# EAGLE design rfidReader (EAGLE 5.04)
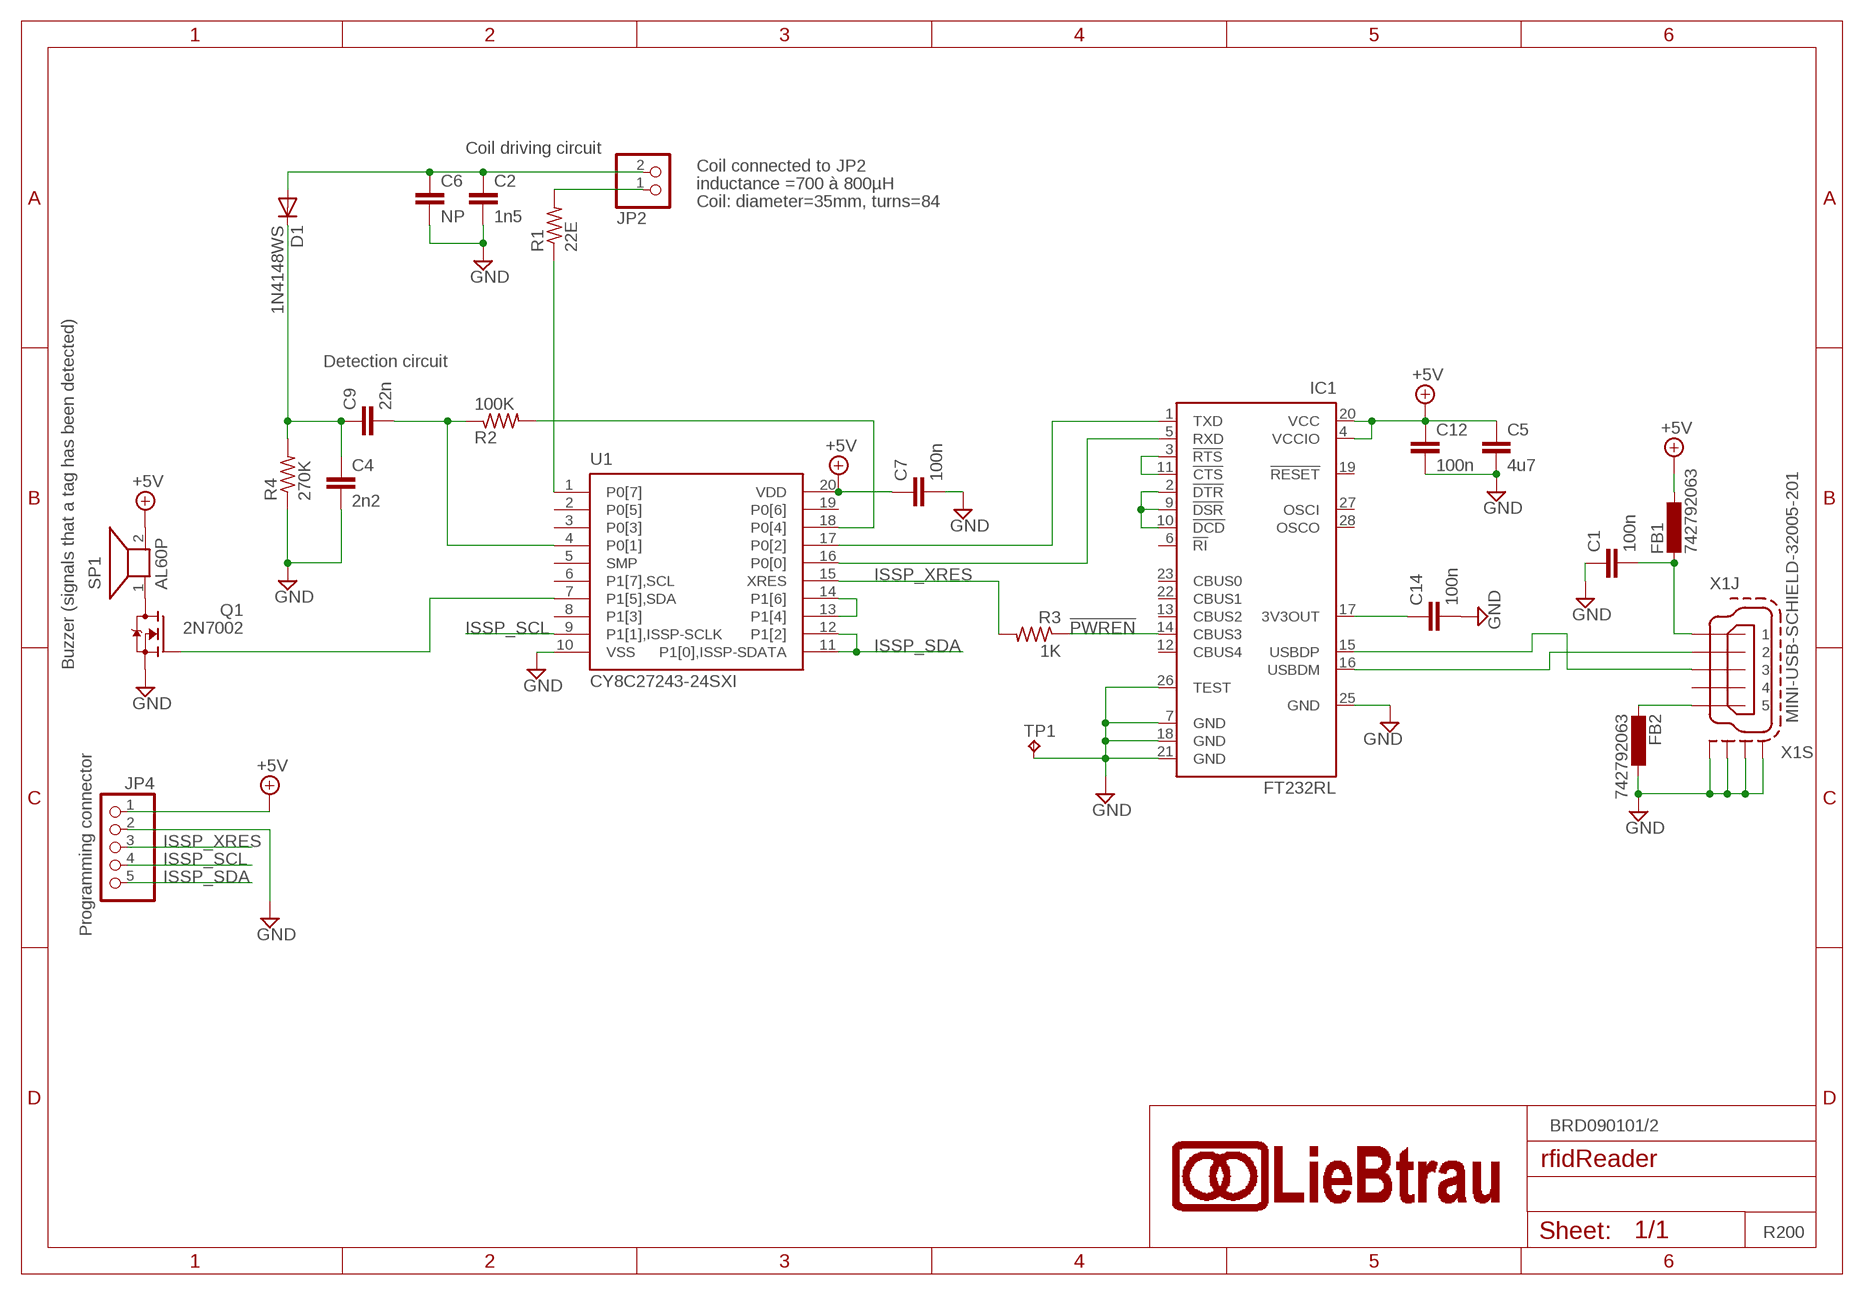
[diagram p0: schematic, sheet 1]

## Parts
C1  100n  C-EUC0805  [C0805]
C2  1n5  C-EUC0805  [C0805]
C4  2n2  C-EUC0805  [C0805]
C5  4u7  C-EUC1206  [C1206]
C6  NP  C-EUC1206  [C1206]
C7  100n  C-EUC0805  [C0805]
C9  22n  C-EUC0805  [C0805]
C12  100n  C-EUC0805  [C0805]
C14  100n  C-EUC0805  [C0805]
D1  1N4148WS  DIODE-SOD323-W  [SOD323-W]
FB1  742792063  [C0805]
FB2  742792063  [C0805]
IC1  FT232RL  [SSOP28]
JP2  PINHD-1X2  [1X02]
JP4  PINHD-1X5  [1X05]
Q1  2N7002  [SOT23]
R1  22E  R-US_R1206  [R1206]
R2  100K  R-US_R0805  [R0805]
R3  1K  R-US_R0805  [R0805]
R4  270K  R-US_R1206  [R1206]
SP1  AL60P  [AL60P]
TP1  TPPAD1-13Y  [P1-13Y]
U1  CY8C27243-24SXI  [SO20W]
X1  MINI-USB-SCHIELD-32005-201  [32005-201]

## Nets
!PWREN: IC1.14(CBUS3) R3.1
+5V: C5.1 C7.1 C12.1 FB1.1 IC1.4(VCCIO) IC1.20(VCC) JP4.1 SP1.2 U1.20(VDD)
GND: C1.1 C2.2 C4.2 C5.2 C6.2 C7.2 C12.2 C14.2 FB2.1 IC1.7(GND) IC1.18(GND) IC1.21(GND) IC1.25(GND) IC1.26(TEST) JP4.2 Q1.2(S) R4.1 TP1.1(TP) U1.10(VSS) X1.M1(S:S1) X1.M2(S:S2) X1.M3(S:S3) X1.M4(S:S4)
ISSP_SCL: JP4.4 U1.9(P1[1],ISSP-SCLK)
ISSP_SDA: JP4.5 U1.11(P1[0],ISSP-SDATA) U1.12(P1[2])
ISSP_XRES: JP4.3 R3.2 U1.15(XRES)
N$1: R1.1 U1.1(P0[7])
N$2: R2.2 U1.18(P0[4])
N$5: JP2.1 R1.2
N$7: FB2.2 X1.5
N$8: IC1.1(TXD) U1.17(P0[2])
N$9: IC1.5(RXD) U1.16(P0[0])
N$11: C4.1 C9.1 D1.C R4.2
N$12: C2.1 C6.1 D1.A JP2.2
N$13: U1.13(P1[4]) U1.14(P1[6])
N$14: IC1.3(!RTS) IC1.11(!CTS)
N$15: IC1.2(!DTR) IC1.9(!DSR) IC1.10(!DCD)
N$16: Q1.1(G) U1.7(P1[5],SDA)
N$17: Q1.3(D) SP1.1
N$21: C1.2 FB1.2 X1.1
N$22: C9.2 R2.1 U1.4(P0[1])
N$27: C14.1 IC1.17(3V3OUT)
USBDM: IC1.16(USBDM) X1.2
USBDP: IC1.15(USBDP) X1.3
Unconnected: IC1.6(!RI) IC1.12(CBUS4) IC1.13(CBUS2) IC1.19(!RESET) IC1.22(CBUS1) IC1.23(CBUS0) IC1.27(OSCI) IC1.28(OSCO) U1.2(P0[5]) U1.3(P0[3]) U1.5(SMP) U1.6(P1[7],SCL) U1.8(P1[3]) U1.19(P0[6]) X1.4

## Notes on the sheet
- Coil driving circuit
- Coil connected to JP2
- inductance =700 à 800µH
- Coil: diameter=35mm, turns=84
- Detection circuit
- Buzzer (signals that a tag has been detected)
- Programming connector
- BRD090101/2
- R200

## Library data of the parts
C1 C2 C4-C7 C9 C12 C14 = rcl:C-EU: CAPACITOR, European symbol
D1 = diode:DIODE-: DIODE
FB1 FB2 = rfid:742792063: WUERTH ELEKTRONIK 742792063 FERRITE, SMD 60OHM, 3A, 0805Series:WE-CBF; Current rating:3000mA; Resistance:0.025ohm; Package/Case:0805; Impedance, typical @ 100 MHz:60ohm;
IC1 = ftdichip:FT232R: Source: http://www.ftdichip.com/Documents/DataSheets/DS_FT232R_v104.pdf
JP2 = pinhead:PINHD-1X2: PIN HEADER
JP4 = pinhead:PINHD-1X5: PIN HEADER
Q1 = rfid:2N7002
R1-R4 = rcl:R-US_: RESISTOR, American symbol
SP1 = buzzer:AL60P: SPEAKER Source: Buerklin
TP1 = testpad:TP: Test pad
U1 = rfid:CY8C27243
X1 = rfid:MINI-USB-SCHIELD-: MINI USB-B Conector Source: www.cypressindustries.com

## Board
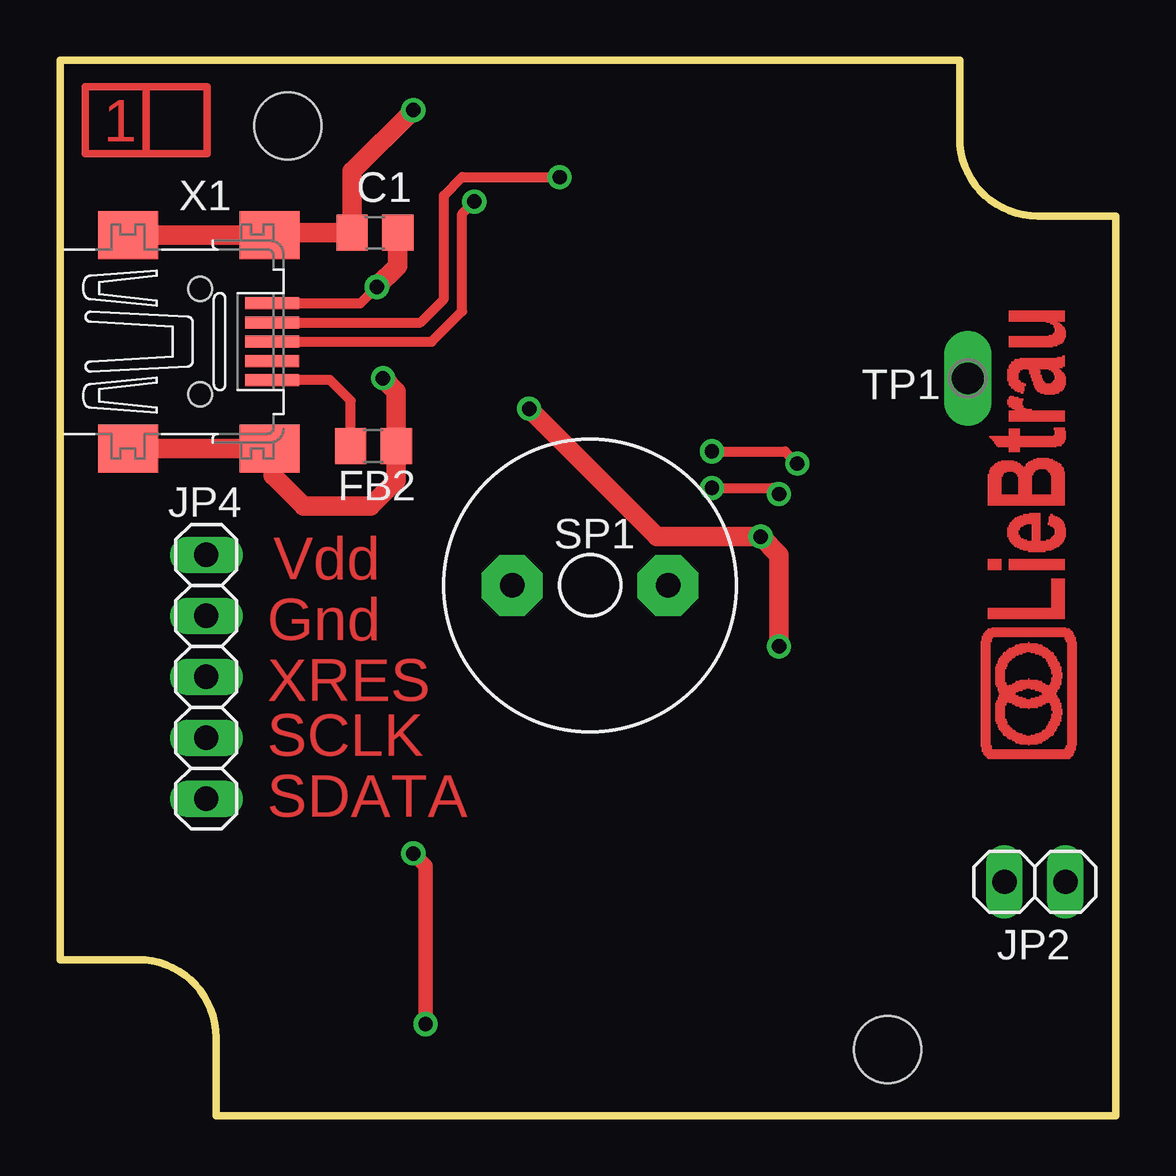
[diagram p1: board, top side]
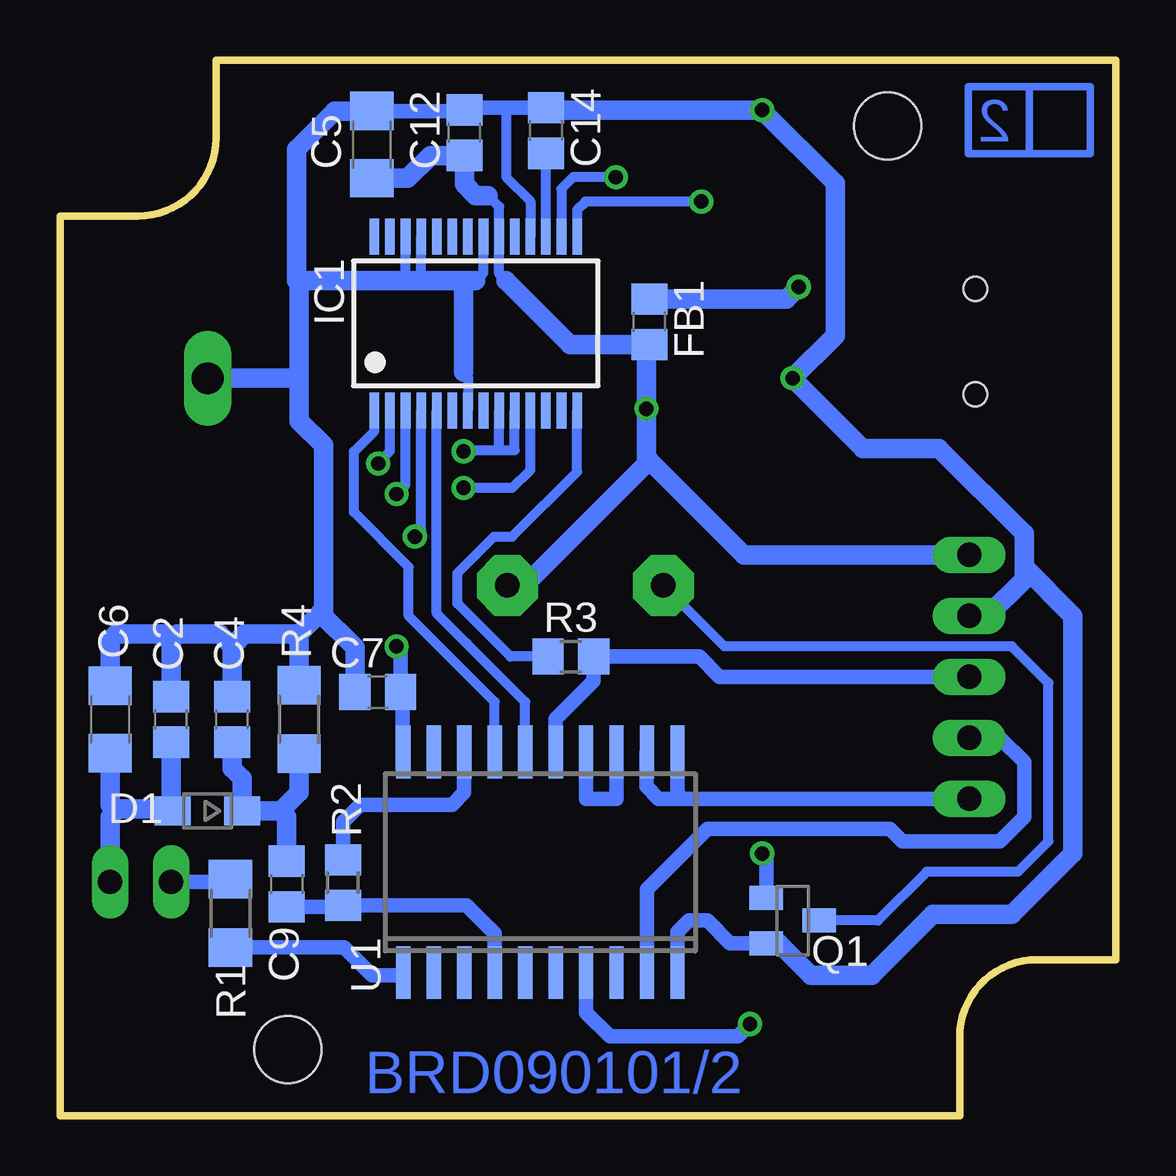
[diagram p2: board, bottom side, seen from below]

Size 44 x 44 mm. Coordinates in mm from the lower left corner, seen from the top.
Outline: 0,44 37.5,44 37.5,40.75 arc90 40.75,37.5 44,37.5 44,0 6.5,0 6.5,3.25 arc90 3.25,6.5 0,6.5 0,44
Copper layers (1*16): Top 0.035mm / dielectric 1.5mm / Bottom 0.035mm
Design rules "default *": minimum track width 10mil, minimum drill 0.6mm, track to track 8mil, track to pad 8mil, pad to pad 8mil, via to via 8mil, smd to smd 8mil, copper to edge 40mil, drill to drill 8mil, minimum pad ring 10mil, minimum via ring 8mil, stop-mask expansion 4mil, vias tented up to drill 0mil, thermal gap 10mil
Holes 2.8 mm at 9.5,41.25 34.5,2.75

### Footprints (pad centres in the part's own frame; a part is rotated, then mirrored left to right if it is on the bottom)
C0805 = smd 1.3 x 1.5: 1 -0.95,0; 2 0.95,0
C1206 = smd 1.6 x 1.8: 1 -1.4,0; 2 1.4,0
SOD323-W = smd 1.5 x 1.2: A 1.45,0; C -1.45,0
SSOP28 = smd 0.4 x 1.5: 1 -4.225,-3.625; 2 -3.575,-3.625; 3 -2.925,-3.625; 4 -2.275,-3.625; 5 -1.625,-3.625; 6 -0.975,-3.625; 7 -0.325,-3.625; 8 0.325,-3.625; 9 0.975,-3.625; 10 1.625,-3.625; 11 2.275,-3.625; 12 2.925,-3.625; 13 3.575,-3.625; 14 4.225,-3.625; 15 4.225,3.625; 16 3.575,3.625; 17 2.925,3.625; 18 2.275,3.625; 19 1.625,3.625; 20 0.975,3.625; 21 0.325,3.625; 22 -0.325,3.625; 23 -0.975,3.625; 24 -1.625,3.625; 25 -2.275,3.625; 26 -2.925,3.625; 27 -3.575,3.625; 28 -4.225,3.625
1X02 = drill 1.016 long: 1 -1.27,0; 2 1.27,0
1X05 = drill 1.016 long: 1 -5.08,0; 2 -2.54,0; 3 0,0; 4 2.54,0; 5 5.08,0
SOT23 = smd 1 x 1.4: 1 -0.95,-1.1; 2 0.95,-1.1; 3 0,1.1
R1206 = smd 1.6 x 1.803: 1 -1.422,0; 2 1.422,0
R0805 = smd 1.3 x 1.5: 1 -0.95,0; 2 0.95,0
AL60P = drill 1.016 pad 2.54 octagon: 1 -3.251,0; 2 3.251,0
P1-13Y = drill 1.321 pad 1.905 long: 1 0,0
SO20W = smd 0.6 x 2.2: 1 -5.715,-4.6; 2 -4.445,-4.6; 3 -3.175,-4.6; 4 -1.905,-4.6; 5 -0.635,-4.6; 6 0.635,-4.6; 7 1.905,-4.6; 8 3.175,-4.6; 9 4.445,-4.6; 10 5.715,-4.6; 11 5.715,4.6; 12 4.445,4.6; 13 3.175,4.6; 14 1.905,4.6; 15 0.635,4.6; 16 -0.635,4.6; 17 -1.905,4.6; 18 -3.175,4.6; 19 -4.445,4.6; 20 -5.715,4.6
32005-201 = smd 2.25 x 0.5: 1 3,1.6; 2 3,0.8; 3 3,0; 4 3,-0.8; 5 3,-1.6 | smd 2.5 x 2: M1 -3,-4.45; M2 -3,4.45; M3 2.9,4.45; M4 2.9,-4.45 | hole 1: 0,2.2; 0,-2.2

### Placement (x,y rotation side)
C1  13.13,36.79 0 top
C2  39.37,16.51 90 bottom
C4  36.83,16.51 90 bottom
C5  31,40.47 90 bottom
C6  41.91,16.51 90 bottom
C7  30.76,17.65 180 bottom
C9  34.54,9.65 270 bottom
C12  27.14,40.97 90 bottom
C14  23.74,41.06 90 bottom
D1  37.85,12.7 180 bottom
FB1  19.43,33.09 90 bottom
FB2  13.07,27.91 180 top
IC1  26.67,33.02 0 bottom
JP2  40.64,9.74 0 top
JP4  6.1,18.29 270 top
Q1  13.46,8.13 270 bottom
R1  36.89,8.42 90 bottom
R2  32.2,9.71 90 bottom
R3  22.7,19.13 0 bottom
R4  34.04,16.51 270 bottom
SP1  22.1,22.1 0 top
TP1  37.85,30.73 180 top
U1  23.98,10.56 0 bottom
U$1  [LIEBTRAU_PCB]  43.18,14.22 90 top
U$2  [A5L-LOC]  -67.31,-51.82 0 top  (outside the outline)
X1  5.84,32.26 0 top

### Tracks (layer width: path | path; a pad name or v marks a point on that pad's centre or on a via)
!PWREN
  Bottom 0.406: IC1.14 22.45,26.83 25.15,24.13 25.91,24.13 27.43,22.61 27.43,21.34 25.23,19.13 R3.1
+5V  (via drill 0.6)
  Top 0.813: v19.56,29.46 24.89,24.13 v29.21,24.13 29.97,23.37 v29.97,19.56
  Bottom 0.406: 26.16,38.35 25.7,37.89 IC1.20 25.7,35.09 25.4,34.8 | IC1.4 28.95,24.37 28.97,24.37 v29.21,24.13
  Bottom 0.61: 29.72,15.13 29.72,14.48 | 29.72,15.13 U1.20 | 29.72,15.13 29.72,17.65 C7.1 29.81,19.22 arc-90 30.06,19.47
  Bottom 0.813: 26.16,38.35 26.67,38.35 27.14,38.82 C12.1 28.56,40.02 29.51,39.07 C5.1 | 25.4,34.8 22.74,32.14 FB1.1 19.56,32.01 v19.56,29.46 19.56,27.43 19.43,27.3 | JP4.1 15.49,23.37 19.43,27.3 | SP1.2 24.64,22.1 19.43,27.3 | v29.97,19.56 30.06,19.47
GND  (via drill 0.6)
  Top 0.813: X1.M2 X1.M3 8.83,36.79 C1.1 12.18,39.36 v14.73,41.91 | X1.M1 X1.M4 8.89,27.66 8.89,26.67 10.16,25.4 12.95,25.4 14.02,26.46 FB2.1 14.02,30.18 v13.46,30.73
  Bottom 0.406: IC1.18 24.39,38.11 25.4,39.12 25.4,42.01 | IC1.26 29.59,34.93 29.46,34.8 | IC1.25 28.95,34.81 28.96,34.8 | IC1.21 26.34,35.12 26.67,34.8 | IC1.7 27,30.8 27.18,30.99
  Bottom 0.61: C14.2 25.4,42.01 27.05,42.01 C12.2 27.19,41.87 C5.2 | Q1.2 16.07,7.18 17.02,8.13 17.78,8.13 18.26,7.65 U1.10
  Bottom 0.813: C14.2 23.64,41.91 v14.73,41.91 11.68,38.86 11.68,32.51 v13.46,30.73 10.54,27.81 7.37,27.81 3.81,24.25 3.81,22.86 | 27.18,34.8 28.93,34.8 28.95,34.81 | 27.18,34.8 26.67,34.8 | 29.21,34.8 28.96,34.8 | 29.21,34.8 29.46,34.8 | 34.14,34.8 34.14,40.28 32.55,41.87 C5.2 | 34.14,34.8 29.21,34.8 | 27.18,34.8 27.18,30.99 | 34.04,30.73 34.04,34.7 34.14,34.8 | 34.04,30.73 34.04,28.96 33.02,27.94 33.02,21.08 33.15,20.95 | C6.2 41.91,19.81 41.66,20.07 39.62,20.07 39.37,19.81 | 39.37,19.81 C2.2 | 36.83,19.56 37.34,20.07 39.12,20.07 39.37,19.81 | 36.83,19.56 C4.2 | 36.83,19.56 36.32,20.07 34.29,20.07 34.04,19.81 R4.1 34.04,20.07 33.15,20.95 | JP4.2 5.33,20.83 3.81,22.35 3.81,22.86 | Q1.2 14.04,7.18 12.7,5.84 10.16,5.84 7.62,8.38 4.32,8.38 1.78,10.92 1.78,20.83 3.81,22.86 | 34.04,30.73 TP1.1 | C7.2 31.71,19.51 33.15,20.95
ISSP_SCL
  Bottom 0.61: U1.9 19.53,9.43 17.02,11.94 9.4,11.94 8.89,11.43 4.83,11.43 3.81,12.45 3.81,14.73 4.83,15.75 JP4.4
ISSP_SDA
  Bottom 0.61: JP4.5 18.03,13.21 | 18.03,13.21 19.05,13.21 19.56,13.72 19.56,15.13 U1.12 | U1.11 18.26,13.44 18.03,13.21
ISSP_XRES
  Bottom 0.61: U1.15 23.34,16.54 21.75,18.12 R3.2 17.35,19.13 16.51,18.29 JP4.3
N$1
  Bottom 0.61: R1.1 32.15,7 30.99,5.84 29.81,5.84 U1.1
N$2
  Bottom 0.61: U1.18 27.15,13.46 27.66,12.95 31.5,12.95 32.2,12.25 R2.2
N$3
  Bottom 0.305: 3.59,42.88 6.13,42.88 6.13,40.09 3.59,40.09 | 3.59,40.09 1.05,40.09 1.05,42.88 3.59,42.88 | 3.59,40.09 3.59,42.88
N$5
  Bottom 0.61: JP2.1 37,9.74 R1.2
N$6
  Top 0.305: 3.59,42.88 6.13,42.88 6.13,40.09 3.59,40.09 | 3.59,40.09 1.05,40.09 1.05,42.88 3.59,42.88 | 3.59,40.09 3.59,42.88
N$7
  Top 0.406: FB2.2 12.12,29.79 11.25,30.66 X1.5
N$8
  Bottom 0.406: U1.17 25.88,17.25 29.46,20.83 29.46,22.86 31.75,25.15 31.75,27.69 30.89,28.54 IC1.1
N$9
  Bottom 0.406: U1.16 24.61,17.25 27.05,19.68 | 27.05,19.68 27.18,19.81 | IC1.5 28.3,20.93 27.05,19.68
N$11
  Bottom 0.813: R4.2 34.04,13.46 34.8,12.7 | 34.8,12.7 D1.C 36.4,14.04 36.83,14.48 C4.1 | 34.8,12.7 34.54,12.45 C9.1
N$12
  Bottom 0.813: 39.37,12.77 C2.1 | 39.37,12.77 D1.A | C6.1 41.91,12.95 41.66,12.7 | 39.37,12.77 41.58,12.77 41.66,12.7 | JP2.2 41.91,12.44 41.66,12.7
N$13
  Bottom 0.61: U1.13 20.8,13.21 22.07,13.21 U1.14
N$14  (via drill 0.6)
  Top 0.406: v27.18,26.16 29.72,26.16 v29.97,25.91
  Bottom 0.406: IC1.11 24.39,26.91 25.15,26.16 v27.18,26.16 | IC1.3 29.59,26.29 v29.97,25.91
N$15  (via drill 0.6)
  Top 0.406: v27.18,27.69 30.23,27.69 v30.73,27.18
  Bottom 0.406: 25.7,27.73 IC1.9 | IC1.2 30.25,27.7 v30.73,27.18 | 25.7,27.73 26.92,27.73 | 26.92,27.73 27.14,27.73 v27.18,27.69 26.96,27.69 26.92,27.73 | 25.7,27.73 25.05,27.73 IC1.10
N$16  (via drill 0.6)
  Top 0.61: v15.24,3.81 15.24,10.41 v14.73,10.92
  Bottom 0.61: U1.7 22.07,4.29 21.08,3.3 15.75,3.3 v15.24,3.81 | Q1.1 14.56,10.75 v14.73,10.92
N$17
  Bottom 0.406: SP1.1 16.31,19.56 4.32,19.56 2.79,18.03 2.79,11.43 4.06,10.16 7.87,10.16 9.91,8.13 Q1.3
N$21  (via drill 0.6)
  Top 0.406: X1.1 12.52,33.86 v13.21,34.54 | 14.08,35.42 C1.2
  Top 0.813: v13.21,34.54 14.08,35.42 | C1.2 14.08,35.45
  Bottom 0.813: FB1.2 13.72,34.04 v13.21,34.54
N$22
  Bottom 0.61: U1.4 25.88,7.59 27.05,8.76 R2.1 32.26,8.7 C9.2
N$27
  Bottom 0.406: IC1.17 C14.1
USBDM  (via drill 0.6)
  Top 0.406: X1.2 15.02,33.06 16,34.04 16,38.35 16.76,39.12 v20.83,39.12
  Bottom 0.406: v20.83,39.12 22.61,39.12 23.09,38.63 IC1.16
USBDP  (via drill 0.6)
  Top 0.406: v17.27,38.1 16.76,37.59 16.76,33.53 15.49,32.26 X1.3
  Bottom 0.406: IC1.15 22.45,37.75 22.1,38.1 v17.27,38.1

### Text on the board
Top: 1 | Vdd | Gnd | XRES | SCLK | SDATA
Bottom: 2 | BRD090101/2
tDocu: BRD090101/2 | 2
bDocu: BRD090101/2 | 2